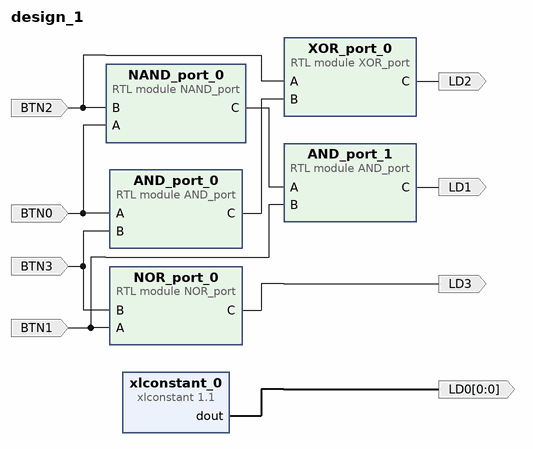
[diagram p0: block diagram of the top level]
# Vivado block design design_1, xc7z020clg400-1, Vivado 2023.1
create_bd_design design_1

create_bd_port -dir I BTN0
create_bd_port -dir I BTN1
create_bd_port -dir I BTN2
create_bd_port -dir I BTN3
create_bd_port -dir O LD1
create_bd_port -dir O LD2
create_bd_port -dir O LD3
create_bd_port -dir O -from 0 -to 0 LD0

create_bd_cell -type module -reference AND_port AND_port_0
create_bd_cell -type module -reference NAND_port NAND_port_0
create_bd_cell -type module -reference AND_port AND_port_1
create_bd_cell -type module -reference XOR_port XOR_port_0
create_bd_cell -type module -reference NOR_port NOR_port_0
create_bd_cell -type ip -vlnv xilinx.com:ip:xlconstant:1.1 xlconstant_0

# ---- connections ----

connect_bd_net [get_bd_pins AND_port_0/C] [get_bd_pins XOR_port_0/B]
connect_bd_net [get_bd_pins AND_port_1/C] [get_bd_ports LD1]
connect_bd_net -net A_0_1 [get_bd_ports BTN0] [get_bd_pins NAND_port_0/A] [get_bd_pins AND_port_0/A]
connect_bd_net -net A_0_2 [get_bd_ports BTN2] [get_bd_pins XOR_port_0/A] [get_bd_pins NAND_port_0/B]
connect_bd_net -net B_0_1 [get_bd_ports BTN1] [get_bd_pins AND_port_1/B] [get_bd_pins NOR_port_0/A]
connect_bd_net -net B_0_2 [get_bd_ports BTN3] [get_bd_pins NOR_port_0/B] [get_bd_pins AND_port_0/B]
connect_bd_net [get_bd_pins NAND_port_0/C] [get_bd_pins AND_port_1/A]
connect_bd_net [get_bd_pins NOR_port_0/C] [get_bd_ports LD3]
connect_bd_net [get_bd_pins XOR_port_0/C] [get_bd_ports LD2]
connect_bd_net [get_bd_pins xlconstant_0/dout] [get_bd_ports LD0]

validate_bd_design
save_bd_design
